# Altium schematic sheet Connector.SchDoc
size A4; Author: Andreas Geiger; CompanyName: Technische Hochschule Nürnberg Georg Simon Ohm; Address1: Wassertorstr. 10; Address2: 90489 Nürnberg; Address3: GERMANY; DocumentNumber: 1; SheetNumber: 1; SheetTotal: 1; CompanyName2: TH Nürnberg
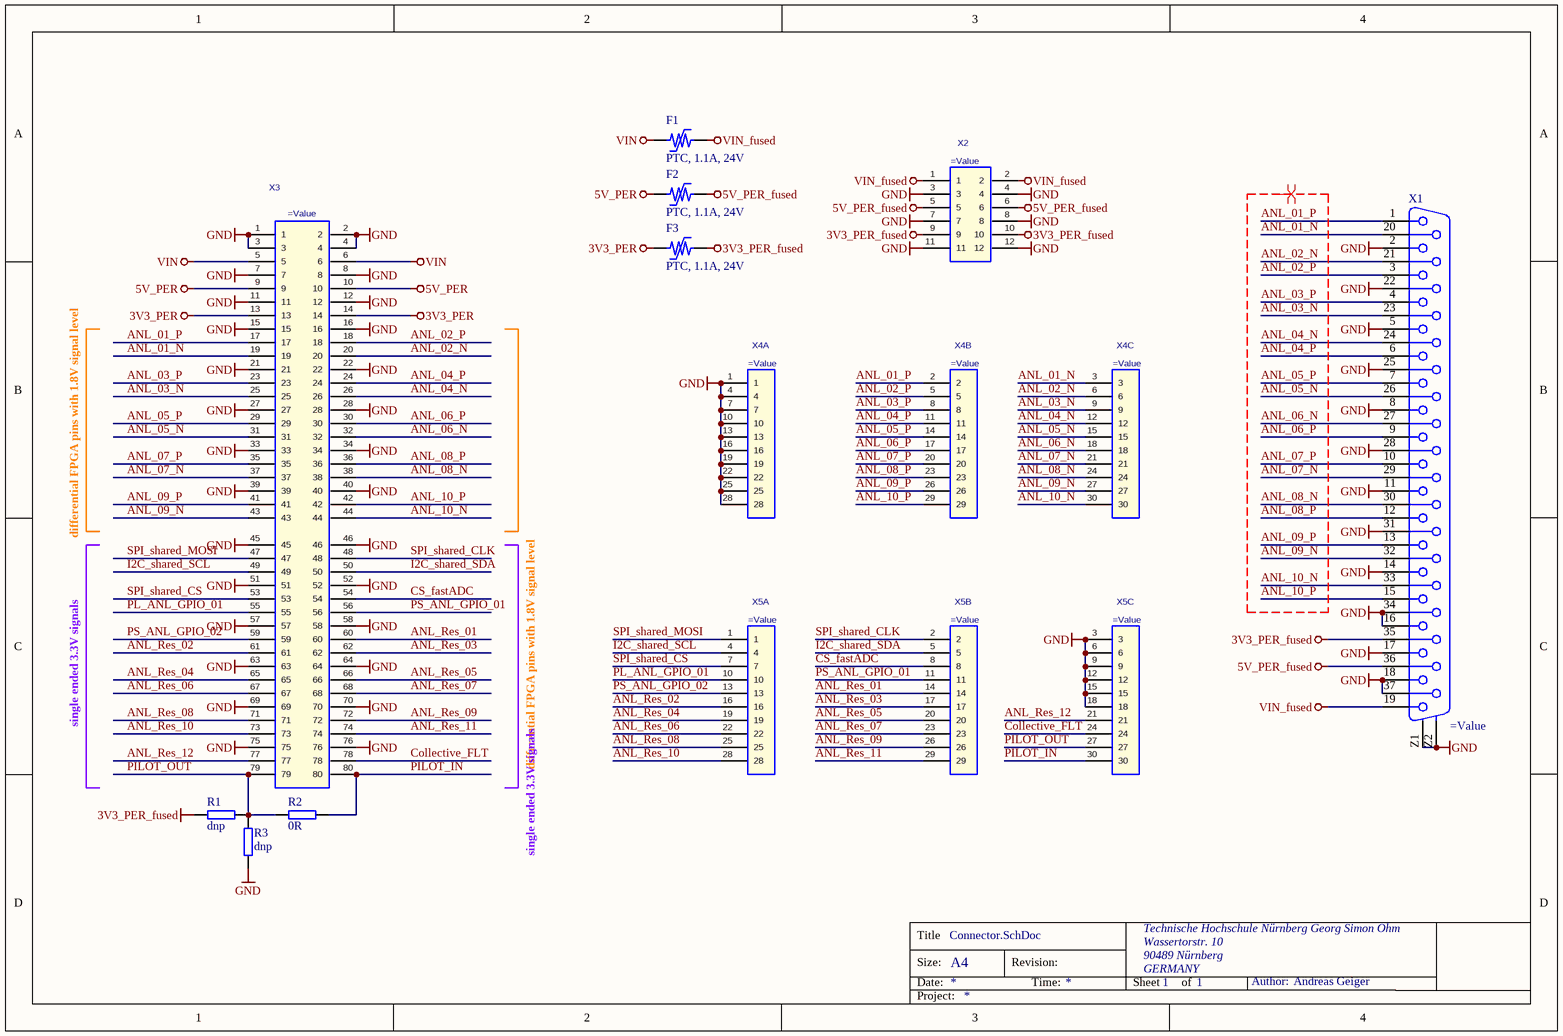
[diagram p0: Connector.SchDoc]

## Parts
F1  PTC, 1.1A, 24V  [1812_PTC_Polyfuse_Littelfuse]
F2  PTC, 1.1A, 24V  [1812_PTC_Polyfuse_Littelfuse]
F3  PTC, 1.1A, 24V  [1812_PTC_Polyfuse_Littelfuse]
R1  dnp  [R_0603_N]
R2  0R  [R_0603_N]
R3  dnp  [R_0603_N]
X1  (no value)  [618037231121]
X2  (no value)  [TSW-106-XX-XXX-D]
X3  (no value)  [HSEC8-140-01-XX-DV-A-BL-CARD]  (no BOM)
X4  (no value)  [TSW-110-XX-XXX-T]  (parts A,B,C of 3)
X5  (no value)  [TSW-110-XX-XXX-T]  (parts A,B,C of 3)

## Nets
3V3_PER: F3.1 X3.13 X3.14
3V3_PER_fused: F3.2 R1.1 X1.35 X2.9 X2.10
5V_PER: F2.1 X3.9 X3.10
5V_PER_fused: F2.2 X1.36 X2.5 X2.6
GND: R3.1 X1.2 X1.5 X1.8 X1.11 X1.14 X1.16 X1.17 X1.18 X1.22 X1.25 X1.28 X1.31 X1.34 X1.37 X1.Z1(GND) X1.Z2(GND) X2.3 X2.4 X2.7 X2.8 X2.11 X2.12 X3.1 X3.2 X3.3 X3.4 X3.7 X3.8 X3.11 X3.12 X3.15 X3.16 X3.21 X3.22 X3.27 X3.28 X3.33 X3.34 X3.39 X3.40 X3.45 X3.46 X3.51 X3.52 X3.57 X3.58 X3.63 X3.64 X3.69 X3.70 X3.75 X3.76 X4.1 X4.4 X4.7 X4.10 X4.13 X4.16 X4.19 X4.22 X4.25 X4.28 X5.3 X5.6 X5.9 X5.12 X5.15 X5.18
VIN: F1.1 X3.5 X3.6
VIN_fused: F1.2 X1.19 X2.1 X2.2
ANL_01_N: X1.20 X3.19 X4.3
ANL_01_P: X1.1 X3.17 X4.2
ANL_02_N: X1.21 X3.20 X4.6
ANL_02_P: X1.3 X3.18 X4.5
ANL_03_N: X1.23 X3.25 X4.9
ANL_03_P: X1.4 X3.23 X4.8
ANL_04_N: X1.24 X3.26 X4.12
ANL_04_P: X1.6 X3.24 X4.11
ANL_05_N: X1.26 X3.31 X4.15
ANL_05_P: X1.7 X3.29 X4.14
ANL_06_N: X1.27 X3.32 X4.18
ANL_06_P: X1.9 X3.30 X4.17
ANL_07_N: X1.29 X3.37 X4.21
ANL_07_P: X1.10 X3.35 X4.20
ANL_08_N: X1.30 X3.38 X4.24
ANL_08_P: X1.12 X3.36 X4.23
ANL_09_N: X1.32 X3.43 X4.27
ANL_09_P: X1.13 X3.41 X4.26
ANL_10_N: X1.33 X3.44 X4.30
ANL_10_P: X1.15 X3.42 X4.29
ANL_Res_01: X3.60 X5.14
ANL_Res_02: X3.61 X5.16
ANL_Res_03: X3.62 X5.17
ANL_Res_04: X3.65 X5.19
ANL_Res_05: X3.66 X5.20
ANL_Res_06: X3.67 X5.22
ANL_Res_07: X3.68 X5.23
ANL_Res_08: X3.71 X5.25
ANL_Res_09: X3.72 X5.26
ANL_Res_10: X3.73 X5.28
ANL_Res_11: X3.74 X5.29
ANL_Res_12: X3.77 X5.21
Collective_FLT: X3.78 X5.24
CS_fastADC: X3.54 X5.8
I2C_shared_SCL: X3.49 X5.4
I2C_shared_SDA: X3.50 X5.5
PILOT_IN: R2.2 X3.80 X5.30
PILOT_OUT: R1.2 R2.1 R3.2 X3.79 X5.27
PL_ANL_GPIO_01: X3.55 X5.10
PS_ANL_GPIO_01: X3.56 X5.11
PS_ANL_GPIO_02: X3.59 X5.13
SPI_shared_CLK: X3.48 X5.2
SPI_shared_CS: X3.53 X5.7
SPI_shared_MOSI: X3.47 X5.1

## Layout directives
differential pair: ANL_01_N, ANL_01_P, ANL_02_N, ANL_02_P, ANL_03_N, ANL_03_P, ANL_04_N, ANL_04_P, ANL_05_N, ANL_05_P, ANL_06_N, ANL_06_P, ANL_07_N, ANL_07_P, ANL_08_N, ANL_08_P, ANL_09_N, ANL_09_P, ANL_10_N, ANL_10_P

## Notes on the sheet
- differential FPGA pins with 1.8V signal level
- single ended 3.3V signals
- Title
- Size:
- Date:
- A4
- Revision:
- Time:
- Sheet
- of
- Author:
- Project:

## Library data of the parts
F1-F3 = Littelfuse_PTC_1812: Resettable PTC Polyfuse SMD, 1812, automotive; MPN: miniASMDC110F/24; Trip Current: 2.2A; Resistance: 0.18Ohm; MF: Littelfuse; Created: 2019_02_10_AGeiger; Package: 1812; ComponentLink1URL: https://www.littelfuse.com/~/media/electronics/datasheets/resettable_ptcs/littelfuse_ptc_surface_mount_catalog_datasheet.pdf.pdf; ComponentLink1Description: Datasheet; Value: PTC, 1.1A, 24V; Voltage: 24V; Hold Current: 1.1A
R1 = R_0603: SMD Resistor 0603; MPN: MCWR06X1002FTL; Value: 10k; Tolerance: 1%; Voltage: 50V; Power: 100mW; Assembly: dnp; MF: Multicomp; Package: 0603; Created: 2018_09_06_AGeiger; Supplier 1: Farnell; Supplier Part Number 1: 2447230
R2 = R_0603: SMD Resistor 0603; MPN: MCMR06X000 PTL; Tolerance: 1%; Voltage: 75V; Power: 100mW; MF: Multicomp; Package: 0603; Value: 0R; Created: 2018_09_06_AGeiger; Supplier 1: Farnell; Supplier Part Number 1: 2073345
R3 = R_0603: SMD Resistor 0603; Value: tbd; Tolerance: 1%; Assembly: dnp; Package: 0603; Created: 2018_09_06_AGeiger; Voltage: tbd; Power: tbd; Supplier 1: *; Supplier Part Number 1: *
X1 = WE-D-Sub Connectors 618037231121: WR-DSUB Female Angled PCB Connector; ComponentLink1 Description: Manufacturer; ComponentLink2 Description: Datasheet; MF: Wuerth Elektronik; NoPins: 37; ComponentLink1URL: http://www.we-online.de; ComponentLink2URL: http://katalog.we-online.de/em/datasheet/6180xx231121.pdf; Created: 2019_02_09_AGeiger; MPN: 618037231121; Value: 618037231121
X2 = TSW-106-XX-XXX-D: Pin Header, 2.54mm; MPN: TSW-106-07-F-D; MF: SAMTEC; Value: TSW-106-07-F-D; Created: 2019_02_10_AGeiger
X3 = HSEC8-140-01-XX-DV-A-BL-CARD: Mating Card Layout for HSEC8-140-01-XX-DV-A-BL; MF: SAMTEC; Created: 2018_04_23_AGeiger; MPN: HSEC8-140-01-XX-DV-A-BL-CARD; Value: HSEC8-140-01-XX-DV-A-BL-CARD
X4 X5 = TSW-110-XX-XXX-T: Pin Header, 2.54mm; MPN: TSW-110-07-F-T; MF: SAMTEC; Value: TSW-110-07-F-T; Created: 2019_02_10_AGeiger